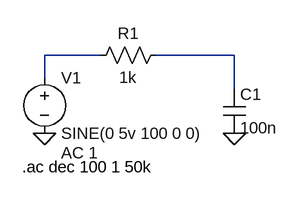
[diagram p0: schematic Draft1.asc]
Draft1.asc, the LTspice schematic file:
Version 4
SHEET 1 880 680
WIRE 64 128 -16 128
WIRE 256 128 144 128
WIRE -16 160 -16 128
WIRE 256 176 256 128
FLAG 256 240 0
FLAG -16 240 0
SYMBOL voltage -16 144 R0
WINDOW 123 24 124 Left 2
WINDOW 39 0 0 Left 0
SYMATTR InstName V1
SYMATTR Value SINE(0 5v 100 0 0)
SYMATTR Value2 AC 1
SYMBOL res 160 112 R90
WINDOW 0 0 56 VBottom 2
WINDOW 3 32 56 VTop 2
SYMATTR InstName R1
SYMATTR Value 1k
SYMBOL cap 240 176 R0
SYMATTR InstName C1
SYMATTR Value 100n
TEXT -48 288 Left 2 !.ac dec 100 1 50k

The netlist it stands for:
* Draft1.asc
V1 N001 0 SINE(0 5v 100 0 0) AC 1
R1 N002 N001 1k
C1 N002 0 100n
.ac dec 100 1 50k
.backanno
.end